# EAGLE design CCDGluing (EAGLE 9.3.2)
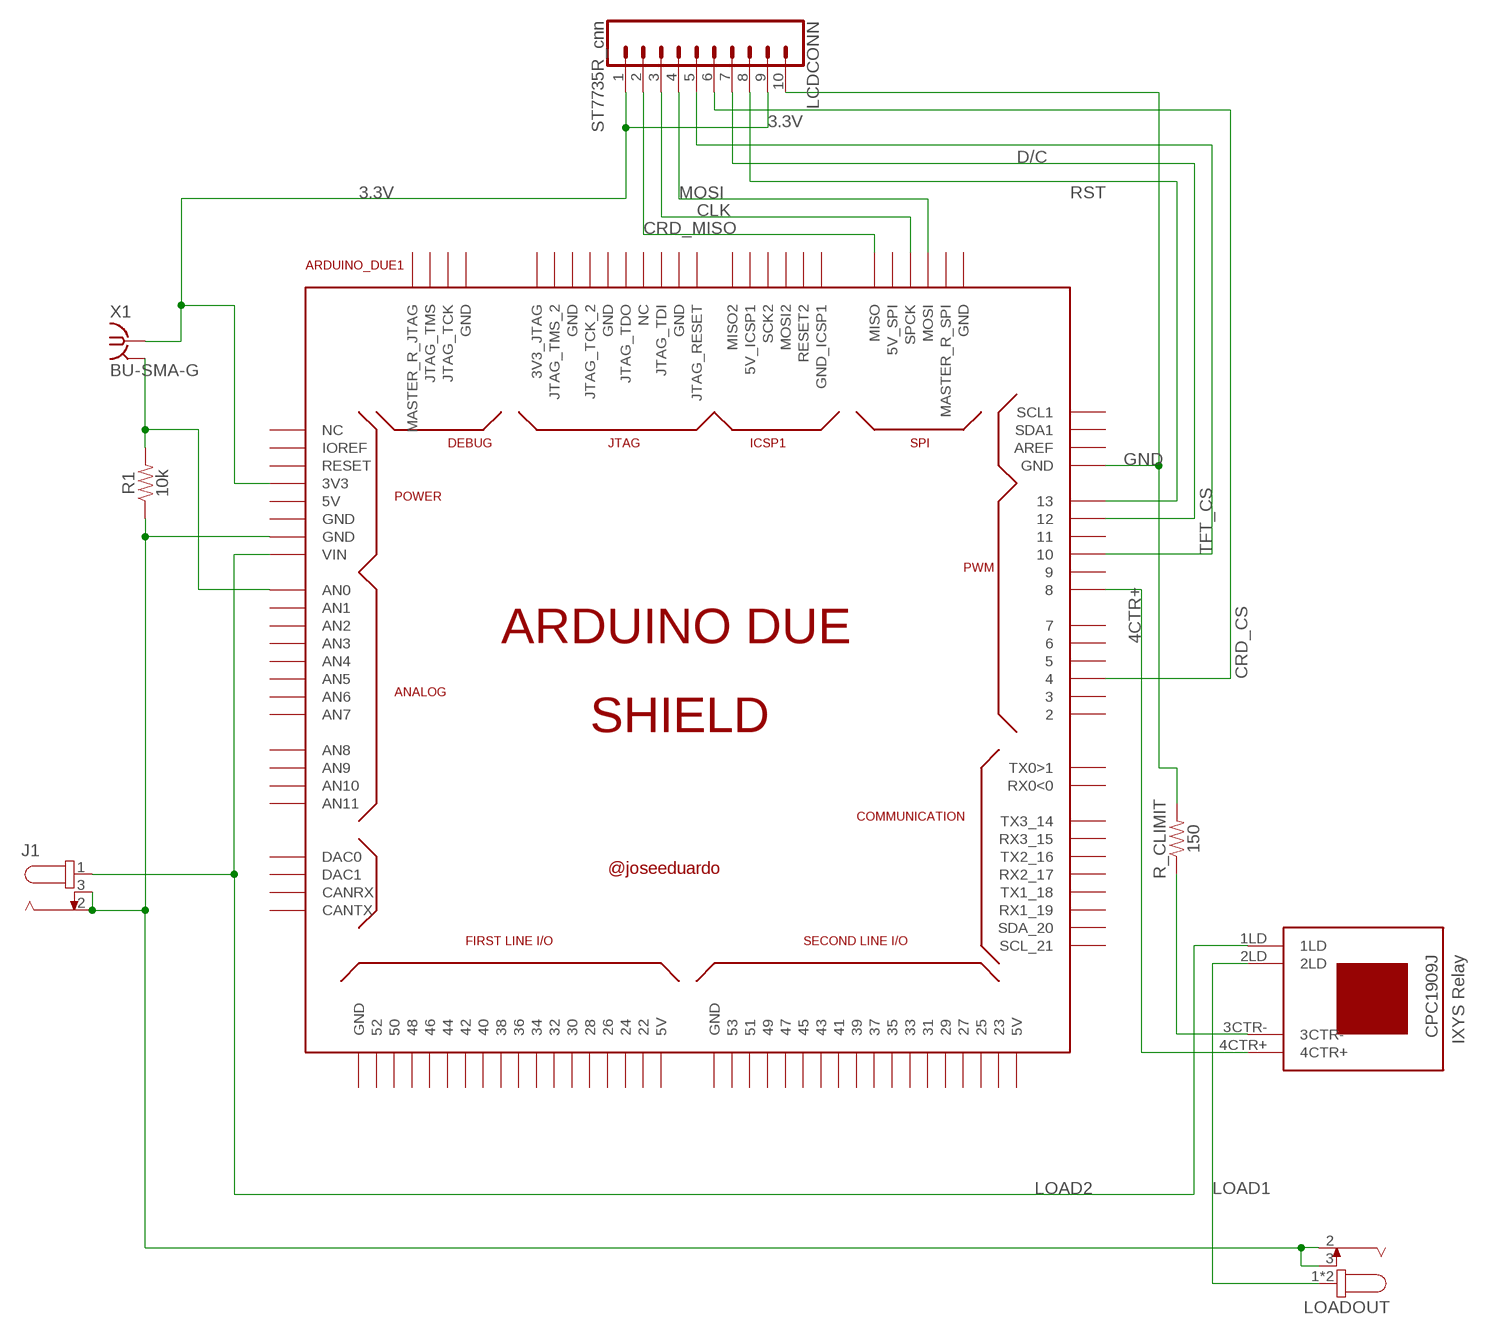
[diagram p0: schematic, sheet 1]

## Parts
ARDUINO_DUE1  ARDUINO_DUE_SHIELD  [ARDUINO_DUE_SHIELD]
J1  694106105102  [69410X105102]
K1  CPC1909J  [CPC1909J]
LCDCONN  ST7735R_cnn  CONN_10"  [1X10]
LOADOUT  694103107102  [69410X107102]
R1  10k  10KOHM-0603-1/10W-1%  [0603]
R_CLIMIT  150  150OHM-0603-1/10W-1%  [0603]
X1  BU-SMA-G  [BU-SMA-G]

## Nets
3.3V: ARDUINO_DUE1.3V3 LCDCONN.1 LCDCONN.9 X1.1
4CTR+: ARDUINO_DUE1.8 K1.4CTR+
CLK: ARDUINO_DUE1.SPCK LCDCONN.3
CRD_CS: ARDUINO_DUE1.4 LCDCONN.6
CRD_MISO: ARDUINO_DUE1.MISO LCDCONN.2
D/C: ARDUINO_DUE1.12 LCDCONN.7
GND: ARDUINO_DUE1.GND_4(GND) LCDCONN.10 R_CLIMIT.2
LOAD1: K1.2LD LOADOUT.1 LOADOUT.A1
LOAD2: ARDUINO_DUE1.VIN J1.1 K1.1LD
LOAD_GND: ARDUINO_DUE1.GND_1(GND) J1.2 J1.3 LOADOUT.2 LOADOUT.3 R1.1
MOSI: ARDUINO_DUE1.MOSI LCDCONN.4
N$1: K1.3CTR- R_CLIMIT.1
N$9: ARDUINO_DUE1.A0(AN0) R1.2 X1.2 X1.3 X1.4 X1.5
RST: ARDUINO_DUE1.13 LCDCONN.8
TFT_CS: ARDUINO_DUE1.10 LCDCONN.5
Unconnected: ARDUINO_DUE1.0(RX0<0) ARDUINO_DUE1.1(TX0>1) ARDUINO_DUE1.2 ARDUINO_DUE1.3 ARDUINO_DUE1.3V3_JTAG ARDUINO_DUE1.5 ARDUINO_DUE1.5V0(5V) ARDUINO_DUE1.5V0_1(5V) ARDUINO_DUE1.5V0_2(5V) ARDUINO_DUE1.5V_2(5V_SPI) ARDUINO_DUE1.5V_ICSP1 ARDUINO_DUE1.6 ARDUINO_DUE1.7 ARDUINO_DUE1.9 ARDUINO_DUE1.11 ARDUINO_DUE1.14(TX3_14) ARDUINO_DUE1.15(RX3_15) ARDUINO_DUE1.16(TX2_16) ARDUINO_DUE1.17(RX2_17) ARDUINO_DUE1.18(TX1_18) ARDUINO_DUE1.19(RX1_19) ARDUINO_DUE1.20(SDA_20) ARDUINO_DUE1.21(SCL_21) ARDUINO_DUE1.22 ARDUINO_DUE1.23 ARDUINO_DUE1.24 ARDUINO_DUE1.25 ARDUINO_DUE1.26 ARDUINO_DUE1.27 ARDUINO_DUE1.28 ARDUINO_DUE1.29 ARDUINO_DUE1.30 ARDUINO_DUE1.31 ARDUINO_DUE1.32 ARDUINO_DUE1.33 ARDUINO_DUE1.34 ARDUINO_DUE1.35 ARDUINO_DUE1.36 ARDUINO_DUE1.37 ARDUINO_DUE1.38 ARDUINO_DUE1.39 ARDUINO_DUE1.40 ARDUINO_DUE1.41 ARDUINO_DUE1.42 ARDUINO_DUE1.43 ARDUINO_DUE1.44 ARDUINO_DUE1.45 ARDUINO_DUE1.46 ARDUINO_DUE1.47 ARDUINO_DUE1.48 ARDUINO_DUE1.49 ARDUINO_DUE1.50 ARDUINO_DUE1.51 ARDUINO_DUE1.52 ARDUINO_DUE1.53 ARDUINO_DUE1.A1(AN1) ARDUINO_DUE1.A2(AN2) ARDUINO_DUE1.A3(AN3) ARDUINO_DUE1.A4(AN4) ARDUINO_DUE1.A5(AN5) ARDUINO_DUE1.A6(AN6) ARDUINO_DUE1.A7(AN7) ARDUINO_DUE1.A8(AN8) ARDUINO_DUE1.A9(AN9) ARDUINO_DUE1.A10(AN10) ARDUINO_DUE1.A11(AN11) ARDUINO_DUE1.AREF ARDUINO_DUE1.CANRX ARDUINO_DUE1.CANTX ARDUINO_DUE1.DAC0 ARDUINO_DUE1.DAC1 ARDUINO_DUE1.GND ARDUINO_DUE1.GND_2(GND) ARDUINO_DUE1.GND_3(GND) ARDUINO_DUE1.GND_5(GND) ARDUINO_DUE1.GND_7(GND) ARDUINO_DUE1.GND_8(GND) ARDUINO_DUE1.GND_9(GND) ARDUINO_DUE1.GND_10(GND) ARDUINO_DUE1.GND_ICSP1 ARDUINO_DUE1.IOREF ARDUINO_DUE1.JTAG_RESET ARDUINO_DUE1.JTAG_TCK ARDUINO_DUE1.JTAG_TCK_2 ARDUINO_DUE1.JTAG_TDI ARDUINO_DUE1.JTAG_TDO ARDUINO_DUE1.JTAG_TMS ARDUINO_DUE1.JTAG_TMS_2 ARDUINO_DUE1.MASTER_RESET_JTAG(MASTER_R_JTAG) ARDUINO_DUE1.MASTER_RESET_SPI(MASTER_R_SPI) ARDUINO_DUE1.MISO2 ARDUINO_DUE1.MOSI2 ARDUINO_DUE1.NC_2(NC) ARDUINO_DUE1.NC_5(NC) ARDUINO_DUE1.RESET ARDUINO_DUE1.RESET2 ARDUINO_DUE1.SCK2 ARDUINO_DUE1.SCL1 ARDUINO_DUE1.SDA1

## Library data of the parts
ARDUINO_DUE1 = arduino_due_shield:ARDUINO_DUE_SHIELD
J1 = Wurth_Elektronik_Electromechanic_DC_Power_Jack_Connectors_rev18b:694106105102: WR-DC_DC Power Jack_Right Angled_SMT Center Pin Ø2.0_Plug ID Ø2.05_Plug OD Ø5.5_with Peg ;=>Code : Con_WR-DC_SMT_694106105102_694106105102 <http://katalog.we-online.de/media/images/v2/Family_WR-DC_DC_Power_Jack_Right_Angled_SMT_694106105102.jpg> Details see: http://katalog.we-online.de/em/datasheet/6941xx105102.pdf Created 2014-10-08, Karrer Zheng 2014 (C) Wurth Elektronik
K1 = pitam:CPC1909J: Description: The CPC1909 is a single-pole normally open (1-Form-A) Solid State Power Relay is rated for up to 15Arms continuous load current with a 5°C/W heat sink. Datasheet CP1909J <http://www.ixysic.com/home/pdfs.nsf/0/E6D9BA0F358C71CD85256F3500603044/$file/CPC1909.pdf> Features: 15A rms Load Current with 5°C/W Heat Sink Low 0.1 Ohm On-Resistance 60VP Blocking Voltage 2500Vrms Input/Output Isolation Low Thermal Impedance: 0.3 °C/W Isolated, Low Thermal Impedance Ceramic Pad for Heat Sink Applications Low Drive Power Requirements Arc-Free With No Snubbing Circuits No EMI/RFI Generation Flammability Rating UL 94 V-0
LCDCONN = SparkFun-Connectors:CONN_10: Multi connection point. Often used as Generic Header-pin footprint for 0.1 inch spaced/style header connections On any of the 0.1 inch spaced packages, you can populate with these: Break Away Headers - Straight <https://www.sparkfun.com/products/116> (PRT-00116) Break Away Male Headers - Right Angle <https://www.sparkfun.com/products/553> (PRT-00553) Female Headers <https://www.sparkfun.com/products/115> (PRT-00115) Break Away Headers - Machine Pin <https://www.sparkfun.com/products/117> (PRT-00117) Break Away Female Headers - Swiss Machine Pin <https://www.sparkfun.com/products/743> (PRT-00743) Arduino Stackable Header - 10 Pin <https://www.sparkfun.com/products/11376> (PRT-11376) For SCREWTERMINALS and SPRING TERMINALS visit here: Screw Terimnals on SparkFun.com <https://www.sparkfun.com/search/results?term=Screw+Terminals> (5mm/3.5mm/2.54mm spacing) This device is also useful as a general connection point to wire up your design to another part of your project. Our various solder wires solder well into these plated through hole pads. Hook-Up Wire - Assortment (Stranded, 22 AWG) <https://www.sparkfun.com/products/11375> (PRT-11375) Hook-Up Wire - Assortment (Solid Core, 22 AWG) <https://www.sparkfun.com/products/11367> (PRT-11367) View the entire wire category on our website here <https://www.sparkfun.com/categories/141> Special notes: Molex polarized connector foot print use with SKU : PRT-08231 with associated crimp pins and housings. 1MM SMD Version SKU: PRT-10208 NOTES ON THE VARIANTS LOCK and LOCK_LONGPADS... This footprint was designed to help hold the alignment of a through-hole component (i.e. 6-pin header) while soldering it into place. You may notice that each hole has been shifted either up or down by 0.005 of an inch from it's more standard position (which is a perfectly straight line). This slight alteration caused the pins (the squares in the middle) to touch the edges of the holes. Because they are alternating, it causes a "brace" to hold the component in place. 0.005 has proven to be the perfect amount of "off-center" position when using our standard breakaway headers. Although looks a little odd when you look at the bare footprint, once you have a header in there, the alteration is very hard to notice. Also,if you push a header all the way into place, it is covered up entirely on the bottom side.; PROD_ID: CONN-11563
LOADOUT = Wurth_Elektronik_Electromechanic_DC_Power_Jack_Connectors_rev18b:694103107102: WR-DC_DC Power Jack_Right Angled_SMT Center Pin Ø1.3_Plug ID Ø1.35_Plug OD Ø3.5_with 4 Soldering Pad & Peg ;=>Code : Con_WR-DC_SMT_6941xx107102_694103107102 <http://katalog.we-online.de/media/images/v2/Family_Con_WR-DC_THT_6941xx304002_pf2.jpg> Details see: http://katalog.we-online.de/em/datasheet/6941xx107102.pdf Created 2014-10-08, Karrer Zheng 2014 (C) Wurth Elektronik
R1 = SparkFun-Resistors:10KOHM: 10kΩ resistor A resistor is a passive two-terminal electrical component that implements electrical resistance as a circuit element. Resistors act to reduce current flow, and, at the same time, act to lower voltage levels within circuits. - Wikipedia; PROD_ID: RES-00824
R_CLIMIT = SparkFun-Resistors:150OHM: 150Ω resistor A resistor is a passive two-terminal electrical component that implements electrical resistance as a circuit element. Resistors act to reduce current flow, and, at the same time, act to lower voltage levels within circuits. - Wikipedia; PROD_ID: RES-11028
X1 = con-coax:BU-SMA-G: FEMALE SMA CONNECTOR Radiall distributor RS 193-9117; OC_FARNELL: unknown; OC_NEWARK: unknown

## Board
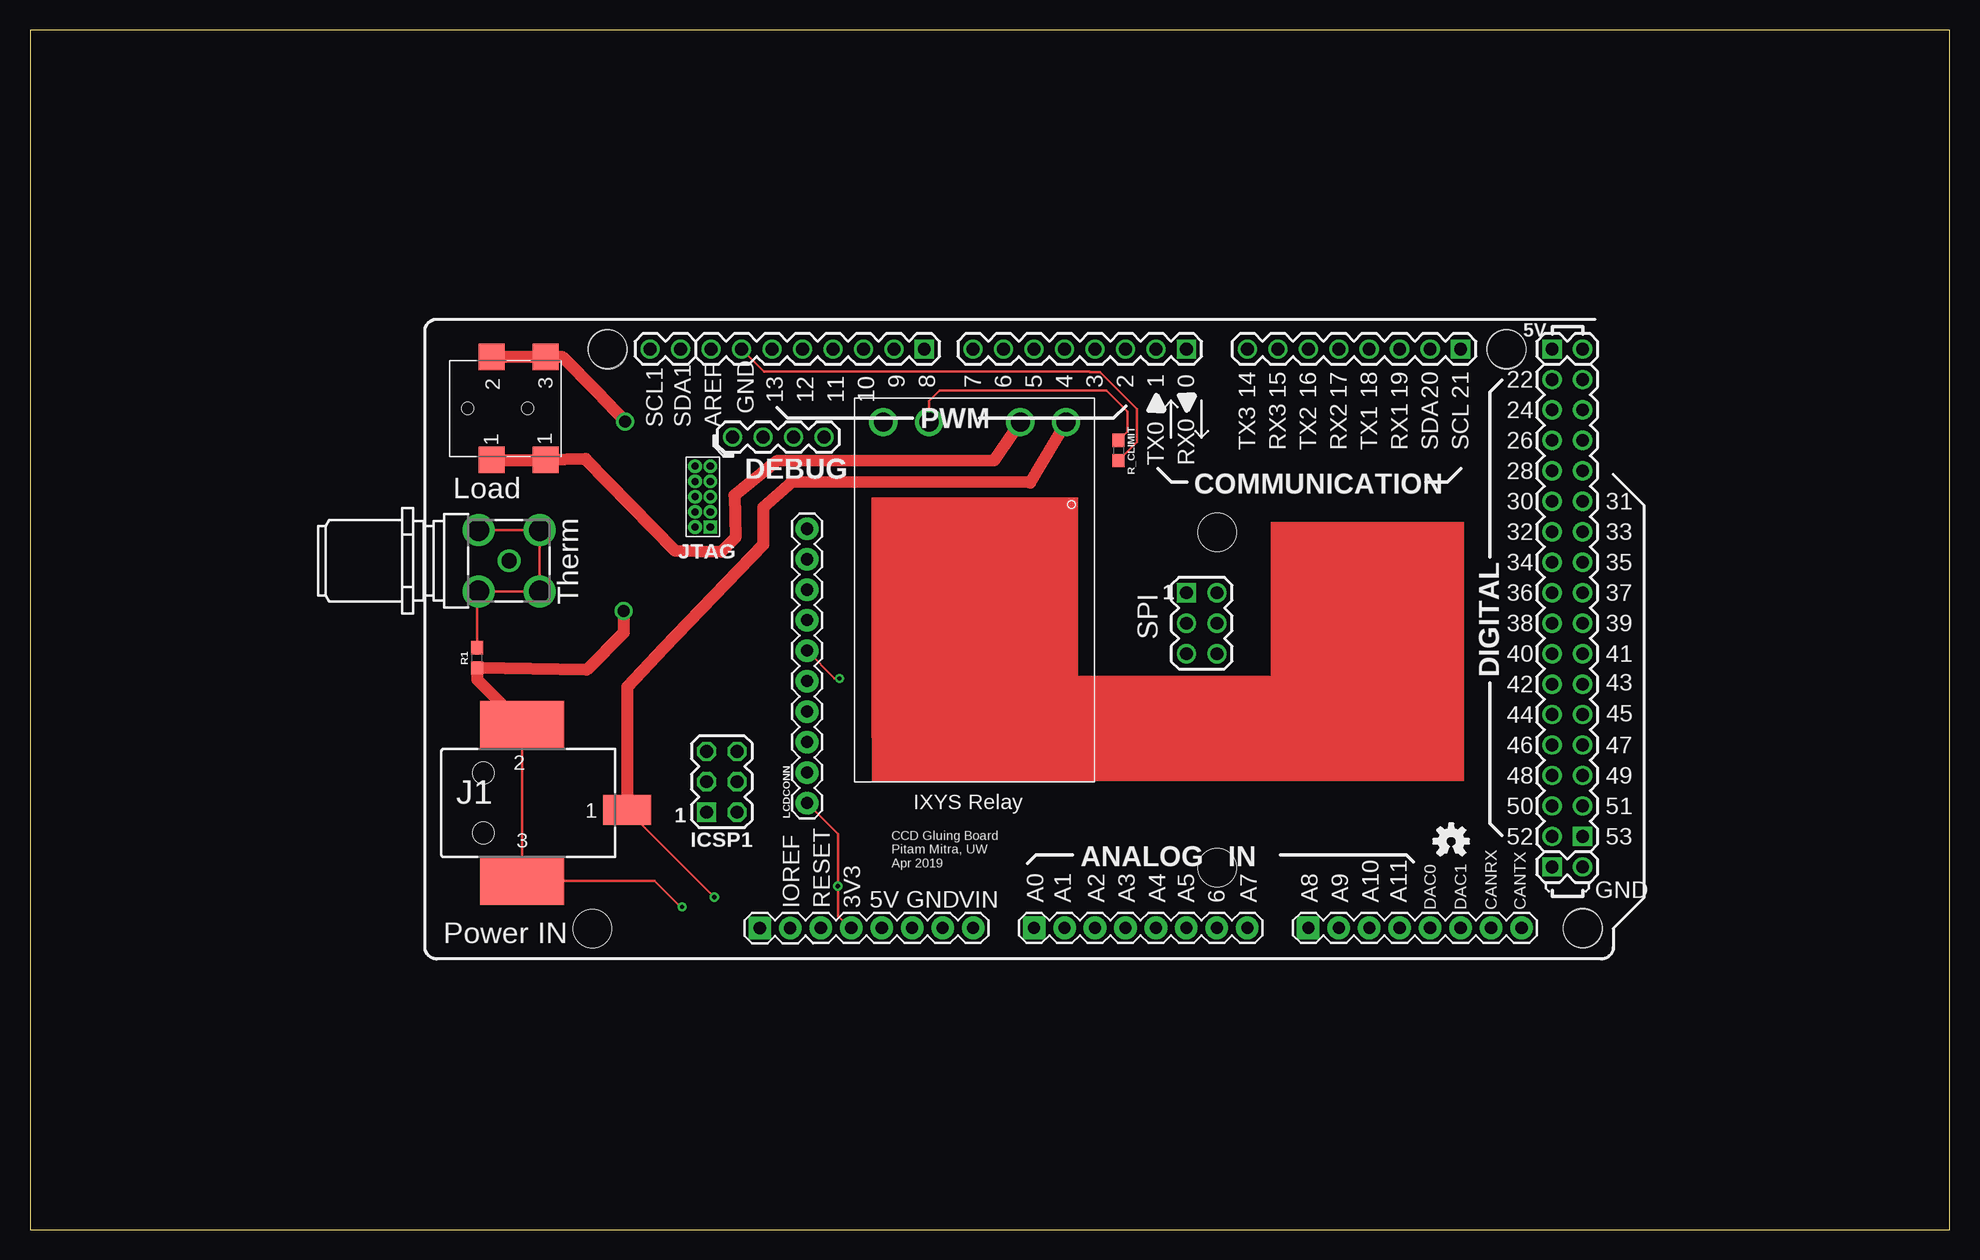
[diagram p1: board, top side]
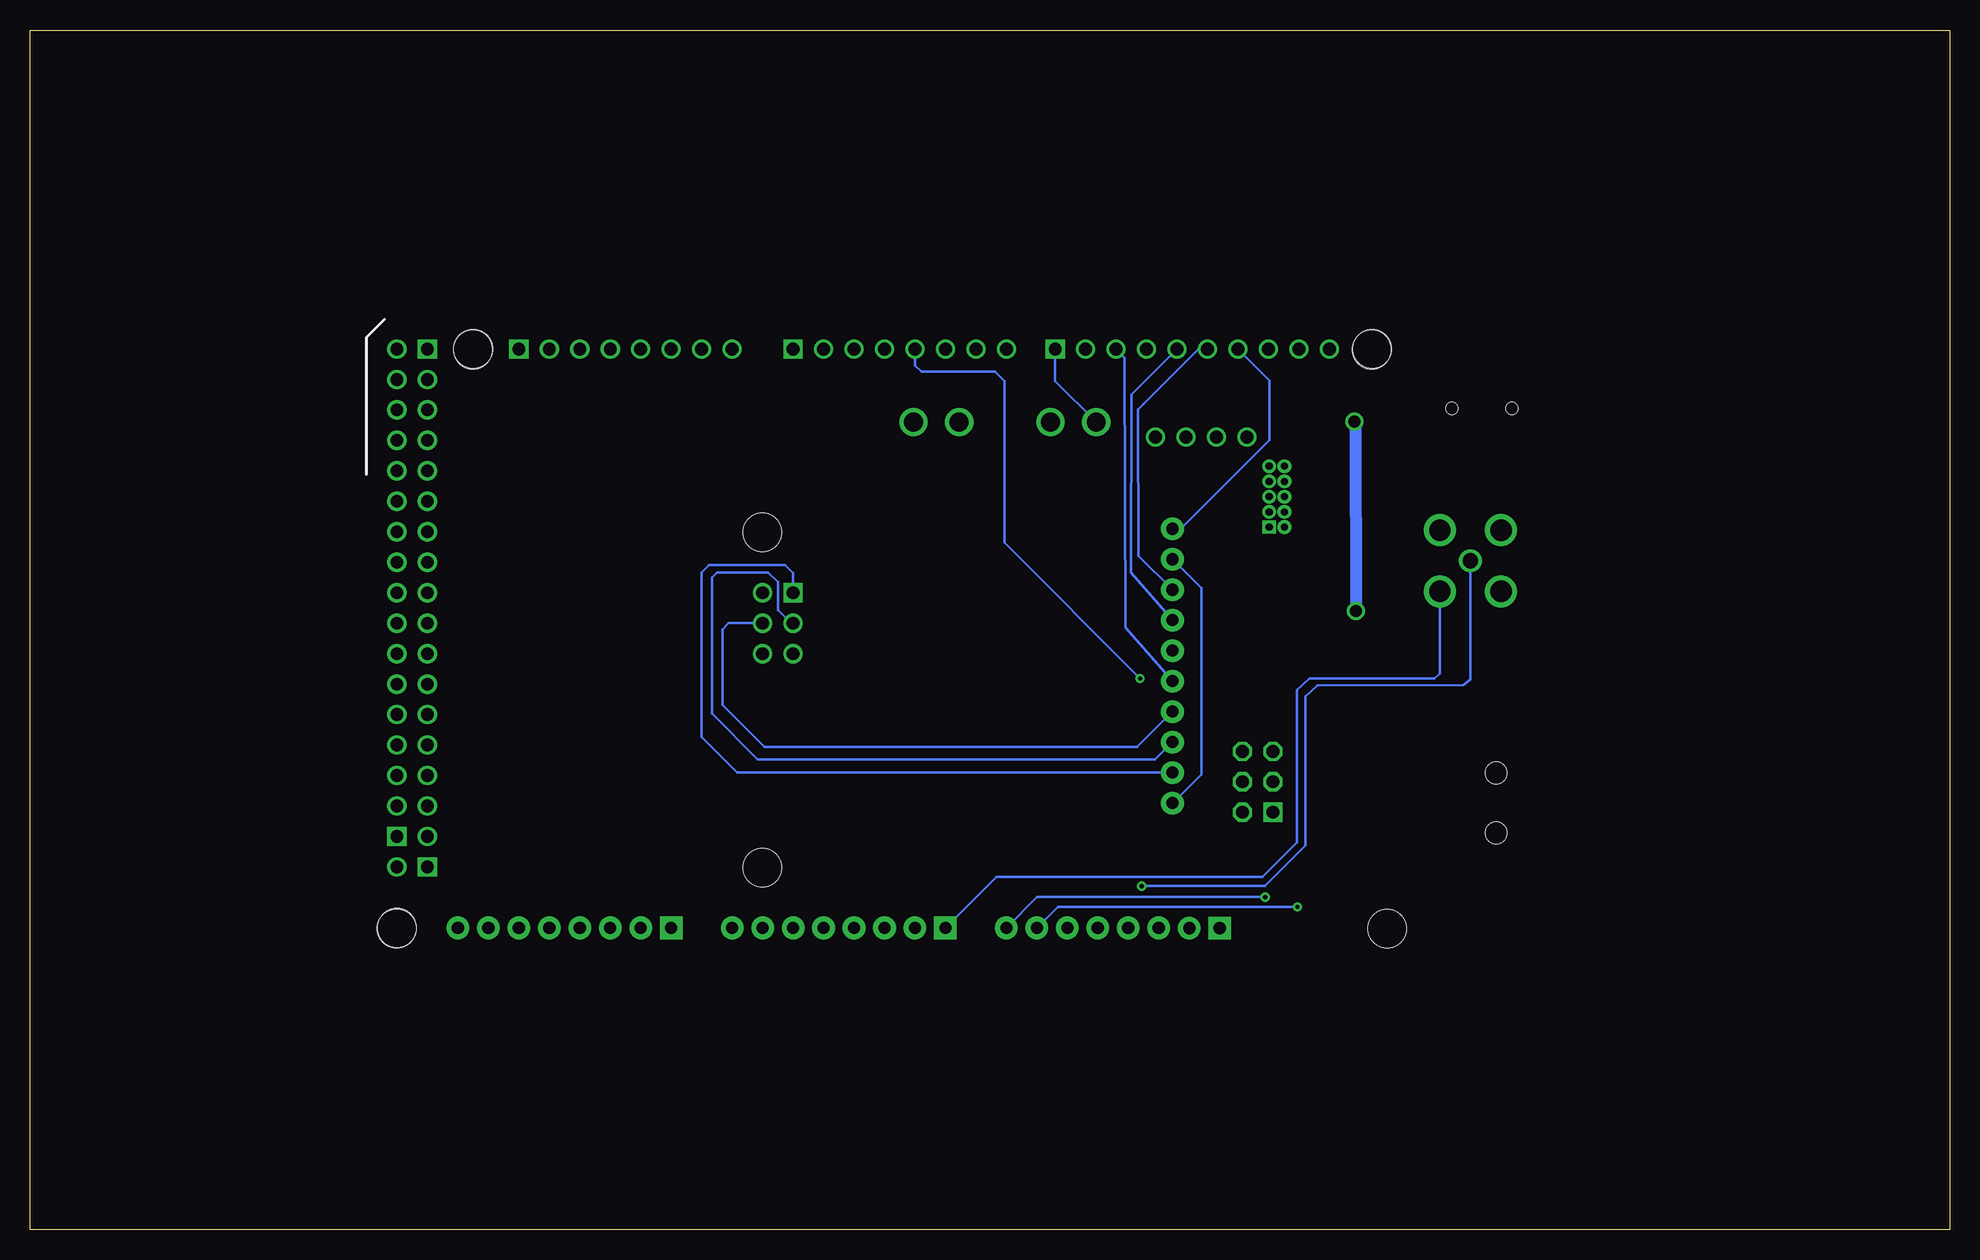
[diagram p2: board, bottom side, seen from below]

Size 160 x 100 mm. Coordinates in mm from the lower left corner, seen from the top.
Outline: 0,0 160,0 160,100 0,100 0,0
Copper layers (1*16): Top 0.035mm / dielectric 1.5mm / Bottom 0.035mm
Design rules "default *": minimum track width 8mil, minimum drill 0.35mm, track to track 8mil, track to pad 8mil, pad to pad 8mil, via to via 8mil, smd to smd 6mil, copper to edge 40mil, drill to drill 6mil, minimum pad ring 10mil, minimum via ring 8mil, stop-mask expansion 4mil, vias tented up to drill 0mil, thermal gap 10mil

### Footprints (pad centres in the part's own frame; a part is rotated, then mirrored left to right if it is on the bottom)
ARDUINO_DUE_SHIELD = drill 1.067 square: 0 63.373,51.816; 5V0_1 93.853,51.816; 8 41.529,51.816; 21 86.233,51.816; 53 96.393,11.176; GND_2 93.853,8.636; MISO 63.373,31.496; MISO2 23.384,13.196 | drill 1.067: 1 60.833,51.816; 2 58.293,51.816; 3 55.753,51.816; 4 53.213,51.816; 5 50.673,51.816; 5V0_2 96.393,51.816; 5V_2 65.913,31.496; 6 48.133,51.816; 7 45.593,51.816; 9 38.989,51.816; 10 36.449,51.816; 11 33.909,51.816; 12 31.369,51.816; 13 28.829,51.816; 14 68.453,51.816; 15 70.993,51.816; 16 73.533,51.816; 17 76.073,51.816; 18 78.613,51.816; 19 81.153,51.816; 20 83.693,51.816; 22 93.853,49.276; 23 96.393,49.276; 24 93.853,46.736; 25 96.393,46.736; 26 93.853,44.196; 27 96.393,44.196; 28 93.853,41.656; 29 96.393,41.656; 30 93.853,39.116; 31 96.393,39.116; 32 93.853,36.576; 33 96.393,36.576; 34 93.853,34.036; 35 96.393,34.036; 36 93.853,31.496; 37 96.393,31.496; 38 93.853,28.956; 39 96.393,28.956; 40 93.853,26.416; 41 96.393,26.416; 42 93.853,23.876; 43 96.393,23.876; 44 93.853,21.336; 45 96.393,21.336; 46 93.853,18.796; 47 96.393,18.796; 48 93.853,16.256; 49 96.393,16.256; 50 93.853,13.716; 51 96.393,13.716; 52 93.853,11.176; AREF 23.749,51.816; GND_3 96.393,8.636; GND_4 26.289,51.816; GND_5 65.913,26.416; GND_7 33.161,44.473; JTAG_TCK 30.621,44.473; JTAG_TMS 28.081,44.473; MASTER_RESET_JTAG 25.541,44.473; MASTER_RESET_SPI 63.373,26.416; MOSI 65.913,28.956; SCL1 18.669,51.816; SDA1 21.209,51.816; SPCK 63.373,28.956 | drill 1.016 pad 1.88: 3V3 35.433,3.556; 5V0 37.973,3.556; A1 53.213,3.556; A2 55.753,3.556; A3 58.293,3.556; A4 60.833,3.556; A5 63.373,3.556; A6 65.913,3.556; A7 68.453,3.556; A9 76.073,3.556; A10 78.613,3.556; A11 81.153,3.556; CANRX 88.773,3.556; CANTX 91.313,3.556; DAC0 83.693,3.556; DAC1 86.233,3.556; GND 40.513,3.556; GND_1 43.053,3.556; IOREF 30.346,3.543; RESET 32.893,3.555; VIN 45.593,3.556 | drill 0.6 pad 1.016 square: 3V3_JTAG 23.689,36.964 | drill 1.067 octagon: 5V_ICSP1 25.924,13.196; GND_ICSP1 25.924,18.276; MOSI2 25.924,15.736; RESET2 23.384,18.276; SCK2 23.384,15.736 | drill 1.016 pad 1.88 square: A0 50.673,3.556; A8 73.533,3.556; NC_2 27.806,3.543 | drill 0.6 pad 1.143: GND_8 23.689,38.234; GND_9 23.689,40.774; GND_10 23.689,42.044; JTAG_RESET 22.419,42.044; JTAG_TCK_2 22.419,38.234; JTAG_TDI 22.419,40.774; JTAG_TDO 22.419,39.504; JTAG_TMS_2 22.419,36.964; NC_5 23.689,39.504 | hole 3.2: 15.113,51.816; 90.043,51.816; 96.393,3.556; 96.418,3.505; 15.138,51.765; 90.068,51.765; 13.868,3.505; 65.938,36.525; 65.938,8.585
69410X105102 = smd 4 x 2.5: 1 15.5,-0.6 | smd 7 x 4: 2 6.75,6.5; 3 6.75,-6.5 | hole 1.8: 3.5,2.5; 3.5,-2.5
CPC1909J = drill 1.57: 1LD -7.62,0; 2LD -3.81,0; 3CTR- 3.81,0; 4CTR+ 7.62,0
1X10 = drill 1.016 pad 1.88: 1 0,0; 2 2.54,0; 3 5.08,0; 4 7.62,0; 5 10.16,0; 6 12.7,0; 7 15.24,0; 8 17.78,0; 9 20.32,0; 10 22.86,0
69410X107102 = smd 2.2 x 2.2: 1 4.3,8; 2 -4.3,3.5; 3 -4.3,8; A1 4.3,3.5 | hole 1: 0,1.5; 0,6.5
0603 = smd 1.1 x 1: 1 -0.85,0; 2 0.85,0
BU-SMA-G = drill 1.27: 1 0,0 | drill 1.778: 2 -2.55,2.55; 3 2.55,2.55; 4 2.55,-2.55; 5 -2.55,-2.55

### Placement (x,y rotation side)
ARDUINO_DUE1  33.02,21.59 0 top
J1  34.29,35.56 0 top
K1  78.74,67.31 180 top
LCDCONN  64.77,35.56 90 top
LOADOUT  34.98,68.45 270 top
R1  37.29,47.65 90 top
R_CLIMIT  90.73,64.95 270 top
U$1  [OSHW-LOGO-S]  118.47,32.36 0 top
X1  39.93,55.75 180 top

### Tracks (layer width: path | path; a pad name or v marks a point on that pad's centre or on a via)
3.3V  (via drill 0.35)
  Top 0.203: LCDCONN.1 67.33,32.99 v67.33,28.63 67.33,26.11 ARDUINO_DUE1.3V3
  Bottom 0.203: X1.1 39.93,45.86 40.54,45.39 52.7,45.36 53.7,44.42 53.7,32.03 57.05,28.63 v67.33,28.63 | LCDCONN.9 62.36,53.47 62.36,37.95 64.75,35.56 LCDCONN.1
4CTR+
  Bottom 0.203: K1.4CTR+ 74.55,70.74 ARDUINO_DUE1.8
CLK
  Bottom 0.203: LCDCONN.3 66.22,39.19 99.34,39.19 103.15,43 103.15,54.36 102.72,54.79 98.48,54.79 97.66,53.98 97.66,51.64 96.57,50.55 ARDUINO_DUE1.SPCK
CRD_CS  (via drill 0.35)
  Top 0.203: LCDCONN.6 67.08,45.95 v67.46,45.95
  Bottom 0.203: v67.46,45.95 78.79,57.28 78.79,70.71 79.58,71.5 85.7,71.5 86.23,72.03 ARDUINO_DUE1.4
CRD_MISO
  Bottom 0.203: LCDCONN.2 101.07,38.1 104.01,41.05 104.01,54.79 103.4,55.4 97.05,55.4 96.39,54.74 ARDUINO_DUE1.MISO
D/C
  Bottom 0.203: LCDCONN.7 | ARDUINO_DUE1.12 68.17,69.62 68.23,54.8 68.22,54.79 LCDCONN.7
GND
  Top 0.203: ARDUINO_DUE1.GND_4 61.19,71.52 88.29,71.52 88.34,71.48 89.2,71.48 92.28,68.4 92.28,65.65 R_CLIMIT.2
  Bottom 0.203: ARDUINO_DUE1.GND_4 56.67,70.76 56.67,65.81 64.06,58.42 LCDCONN.10
LOAD1
  Top 1.016: K1.2LD 80.39,64.14 62.27,64.09 58.73,61.23 58.8,57.67 57.61,56.5 53.8,56.57 46.33,64.24 LOADOUT.1 LOADOUT.A1
LOAD2  (via drill 0.35)
  Top 0.203: J1.1 v57.04,27.71
  Top 1.016: K1.1LD 83.36,62.26 63.5,62.33 61.11,60.2 61.11,57.1 52.81,48.46 49.78,45.24 J1.1
  Bottom 0.203: ARDUINO_DUE1.VIN 76.05,27.71 v57.04,27.71
LOAD_GND  (via drill 0.35, 1.02)
  Top 0.203: J1.2 J1.3 52.06,29.06 54.22,26.9 v54.35,26.9
  Top 1.016: J1.2 41.04,42.09 37.29,45.84 R1.1 46.38,46.66 49.48,49.76 v49.48,51.56 | v49.61,67.36 47.26,69.83 44.34,72.75 LOADOUT.3 LOADOUT.2
  Bottom 0.203: ARDUINO_DUE1.GND_1 74.32,26.9 v54.35,26.9
  Bottom 1.016: v49.61,67.36 49.52,67.28 v49.48,51.56
MOSI
  Bottom 0.203: LCDCONN.4 67.72,40.23 98.78,40.23 102.29,43.74 102.29,50.04 101.78,50.55 ARDUINO_DUE1.MOSI
N$1
  Top 0.203: K1.3CTR- 74.93,69.06 75.79,69.93 89.71,69.93 91.47,68.17 91.47,66.53 R_CLIMIT.1
N$9
  Top 0.203: R1.2 37.29,53.11 X1.3 X1.2 X1.5 X1.4
  Bottom 0.203: X1.2 42.48,46.36 42.93,45.95 53.37,45.95 54.41,44.98 54.41,32.26 57.28,29.39 79.45,29.39 ARDUINO_DUE1.A0
RST
  Bottom 0.203: ARDUINO_DUE1.13 62.59,73.41 67.21,68.79 67.66,68.38 67.61,56.16 LCDCONN.8
TFT_CS
  Bottom 0.203: ARDUINO_DUE1.10 68.76,72.69 68.7,50.19 LCDCONN.5
(copper drawn outside any net)
  shapes: Top area x2

### Text on the board
tPlace: Load | Therm | CCD Gluing Board / Pitam Mitra, UW / Apr 2019 | Power IN